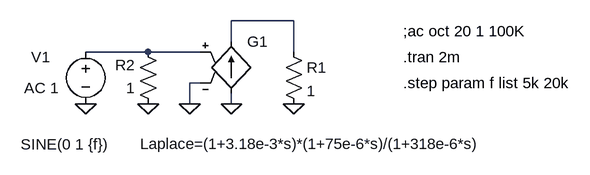
[diagram p0: schematic Lap.asc]
Lap.asc, the LTspice schematic file:
Version 4
SHEET 1 880 680
WIRE 32 64 32 96
WIRE 32 176 32 192
WIRE -16 160 -32 160
WIRE 32 64 128 64
WIRE 128 64 128 112
WIRE -16 112 -96 112
WIRE -96 112 -192 112
WIRE -32 160 -32 192
FLAG 32 192 0
FLAG -32 192 0
FLAG 128 192 0
FLAG -96 192 0
FLAG -192 192 0
SYMBOL voltage -192 96 R0
WINDOW 0 -84 24 Left 0
WINDOW 3 -100 159 Left 0
WINDOW 123 -95 72 Left 0
WINDOW 39 24 160 Left 0
SYMATTR InstName V1
SYMATTR Value SINE(0 1 {f})
SYMATTR Value2 AC 1
SYMBOL res 112 96 R0
SYMATTR InstName R1
SYMATTR Value 1
SYMBOL res -80 208 R180
WINDOW 0 36 76 Left 0
WINDOW 3 36 40 Left 0
SYMATTR InstName R2
SYMATTR Value 1
SYMBOL g 32 80 R0
WINDOW 3 -140 174 Left 0
SYMATTR InstName G1
SYMATTR Value Laplace=(1+3.18e-3*s)*(1+75e-6*s)/(1+318e-6*s)
TEXT 296 80 Left 0 !;ac oct 20 1 100K
TEXT 296 120 Left 0 !.tran 2m
TEXT 296 160 Left 0 !.step param f list 5k 20k

The netlist it stands for:
* Lap.asc
V1 N002 0 SINE(0 1 {f}) AC 1
R1 N001 0 1
R2 0 N002 1
G1 0 N001 N002 0 Laplace=(1+3.18e-3*s)*(1+75e-6*s)/(1+318e-6*s)
;ac oct 20 1 100K
.tran 2m
.step param f list 5k 20k
.backanno
.end